# Altium schematic sheet USBFX2LP_2.SchDoc: USBFX-2
size A; Revision: 04
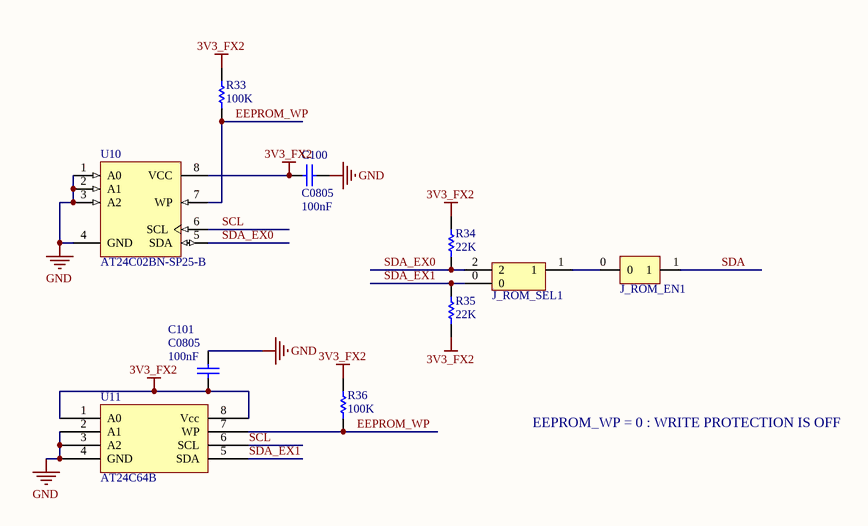
[diagram p0: USBFX2LP_2.SchDoc]

## Parts
C100  C0805  value 100nF  [0805]
C101  C0805  value 100nF  [0805]
J_ROM_EN1  2pin  [2PIN]  (value not drawn)
J_ROM_SEL1  3pin  [3PIN]  (value not drawn)
R33  100K  [ERA-0805]
R34  22K  [ERA-0805]
R35  22K  [ERA-0805]
R36  100K  [ERA-0805]
U10  AT24C02BN-SP25-B  [8S1_N]
U11  AT24C64B  [AT24C512B]

## Nets
3V3_FX2: C100.2 C101.1 R33.1 R34.1 R35.1 R36.1 U10.8(VCC) U11.1(A0) U11.8(Vcc)
GND: C100.1 C101.2 U10.1(A0) U10.2(A1) U10.3(A2) U10.4(GND) U11.2(A1) U11.3(A2) U11.4(GND)
EEPROM_WP: R33.2 R36.2 U10.7(WP) U11.7(WP)
SCL: U10.6(SCL) U11.6(SCL)
SDA: J_ROM_EN1.1
SDA_EX0: J_ROM_SEL1.2 R34.2 U10.5(SDA)
SDA_EX1: J_ROM_SEL1.0 R35.2 U11.5(SDA)
NetJ_ROM_EN1_0: J_ROM_EN1.0 J_ROM_SEL1.1

## Notes on the sheet
- EEPROM_WP = 0 : WRITE PROTECTION IS OFF
- Engineer:
- Title:
- Saleh Jamali
- Revision:

## Library data of the parts
C100 C101 = C0805: Ceramic Chip Capacitor - Standard; Note: Footprint corresponds to dimensions for bulk cassette packaging. This case size has tightened tolerances.; Published: 17-Jul-2002; LatestRevisionDate: 19-Mar-2004; LatestRevisionNote: Silkscreen size reduced.; DatasheetDocument: Mar-2001; PackageDocument: Mar-2001; PackageReference: 0805; Publisher: Altium Limited; Code_JEITA: 0805; Code_IPC: 2012[0805]; ComponentLink1Description: Manufacturer Link; ComponentLink1URL: http://www.kemet.com/; ComponentLink2Description: Datasheet; ComponentLink2URL: http://www.kemet.com/kemet/web/homepage/kechome.nsf/vapubfilesname/F3102TA.pdf/$file/F3102TA.pdf
R33-R36 = ERA6Y: Rectangular Thick Film Chip Resistor, 10 Ohm to 1M Ohm Range, 0.1% and 0.5% Tolerance, 0805 Size, 0.1 W; Note: If flow soldering, adjust pad width of PCB Footprint to 0.7 - 0.8 times the width of the resistor.; Published: 17-Dec-2003; LatestRevisionDate: 19-Mar-2004; LatestRevisionNote: Silkscreen size reduced.; PackageDocument: Mar-2003; PackageReference: ERA-0805; Publisher: Altium Limited; Code_IPC: 2012 [0805]; ComponentLink1Description: Manufacturer Link; ComponentLink1URL: http://www.panasonic.com/industrial/components/resistive_products.htm; ComponentLink2Description: Datasheet; ComponentLink2URL: http://www.panasonic.com/industrial/components/pdf/AOA0000CE8.pdf
U10 = AT24C02BN-SP25-B: 2Kbit (256 x 8), 2-wire Bus Automotive Serial EEPROM with full memory Write Protect, 2.5V, 8-Pin SOIC, Bulk; DatasheetVersion: 8517C,  Jan-2009; PackageVersion: revC, Mar-2005; PackageReference: 8S1; PackageDescription: 8-Lead (0.150" Wide Body), Plastic Gull Wing Small Outline (JEDEC SOIC); Code_JEDEC: MS-012-AA; Code_IPC: SOIC127P600-8; ComponentLink1Description: Manufacturer URL; ComponentLink1URL: http://www.atmel.com/; ComponentLink2Description: Datasheet; ComponentLink2URL: http://www.atmel.com/dyn/resources/prod_documents/doc8517.pdf
U11 = AT24C512B SOIC8 PITCH 1.27